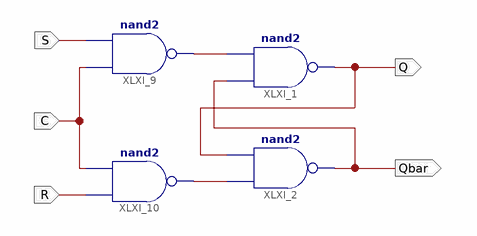
[diagram p0: schematic sheet 1]
// Xilinx ISE schematic CSR_Latch.sch (kintex7) as structural Verilog: 4 symbols, 5 ports
module CSR_Latch (
  input  C,
  input  S,
  input  R,
  output Qbar,
  output Q
);

  wire XLXN_23, XLXN_24;

  nand XLXI_1 (Q, Qbar, XLXN_24);
  nand XLXI_2 (Qbar, XLXN_23, Q);
  nand XLXI_9 (XLXN_24, C, S);
  nand XLXI_10 (XLXN_23, R, C);
endmodule
